# EAGLE design TSOC_GROVEY_FOUR (EAGLE 6.6.0)
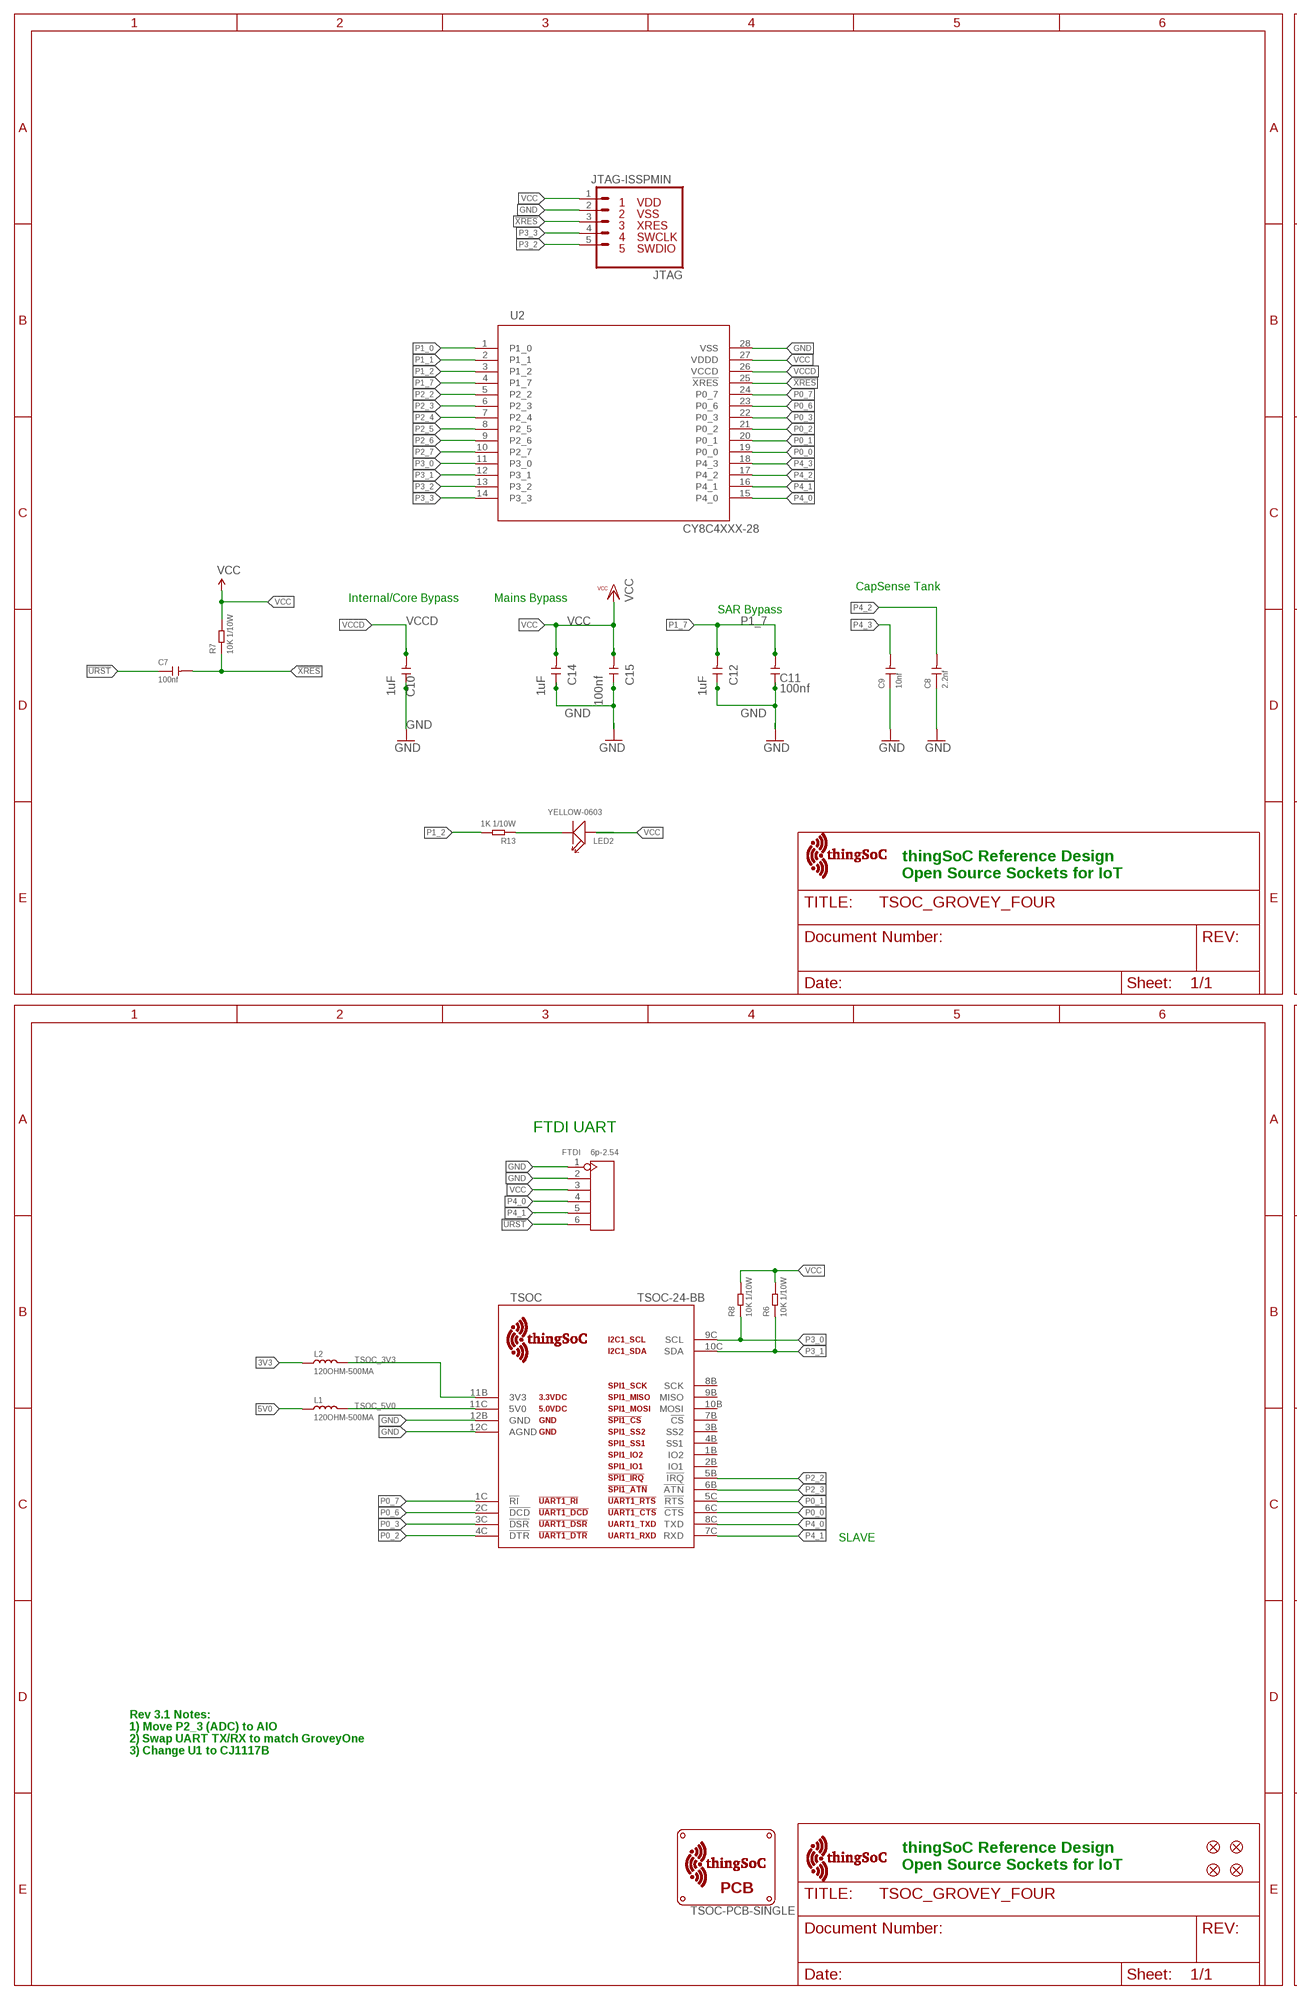
[diagram p0: schematic, sheet 1, part 1 of 2]
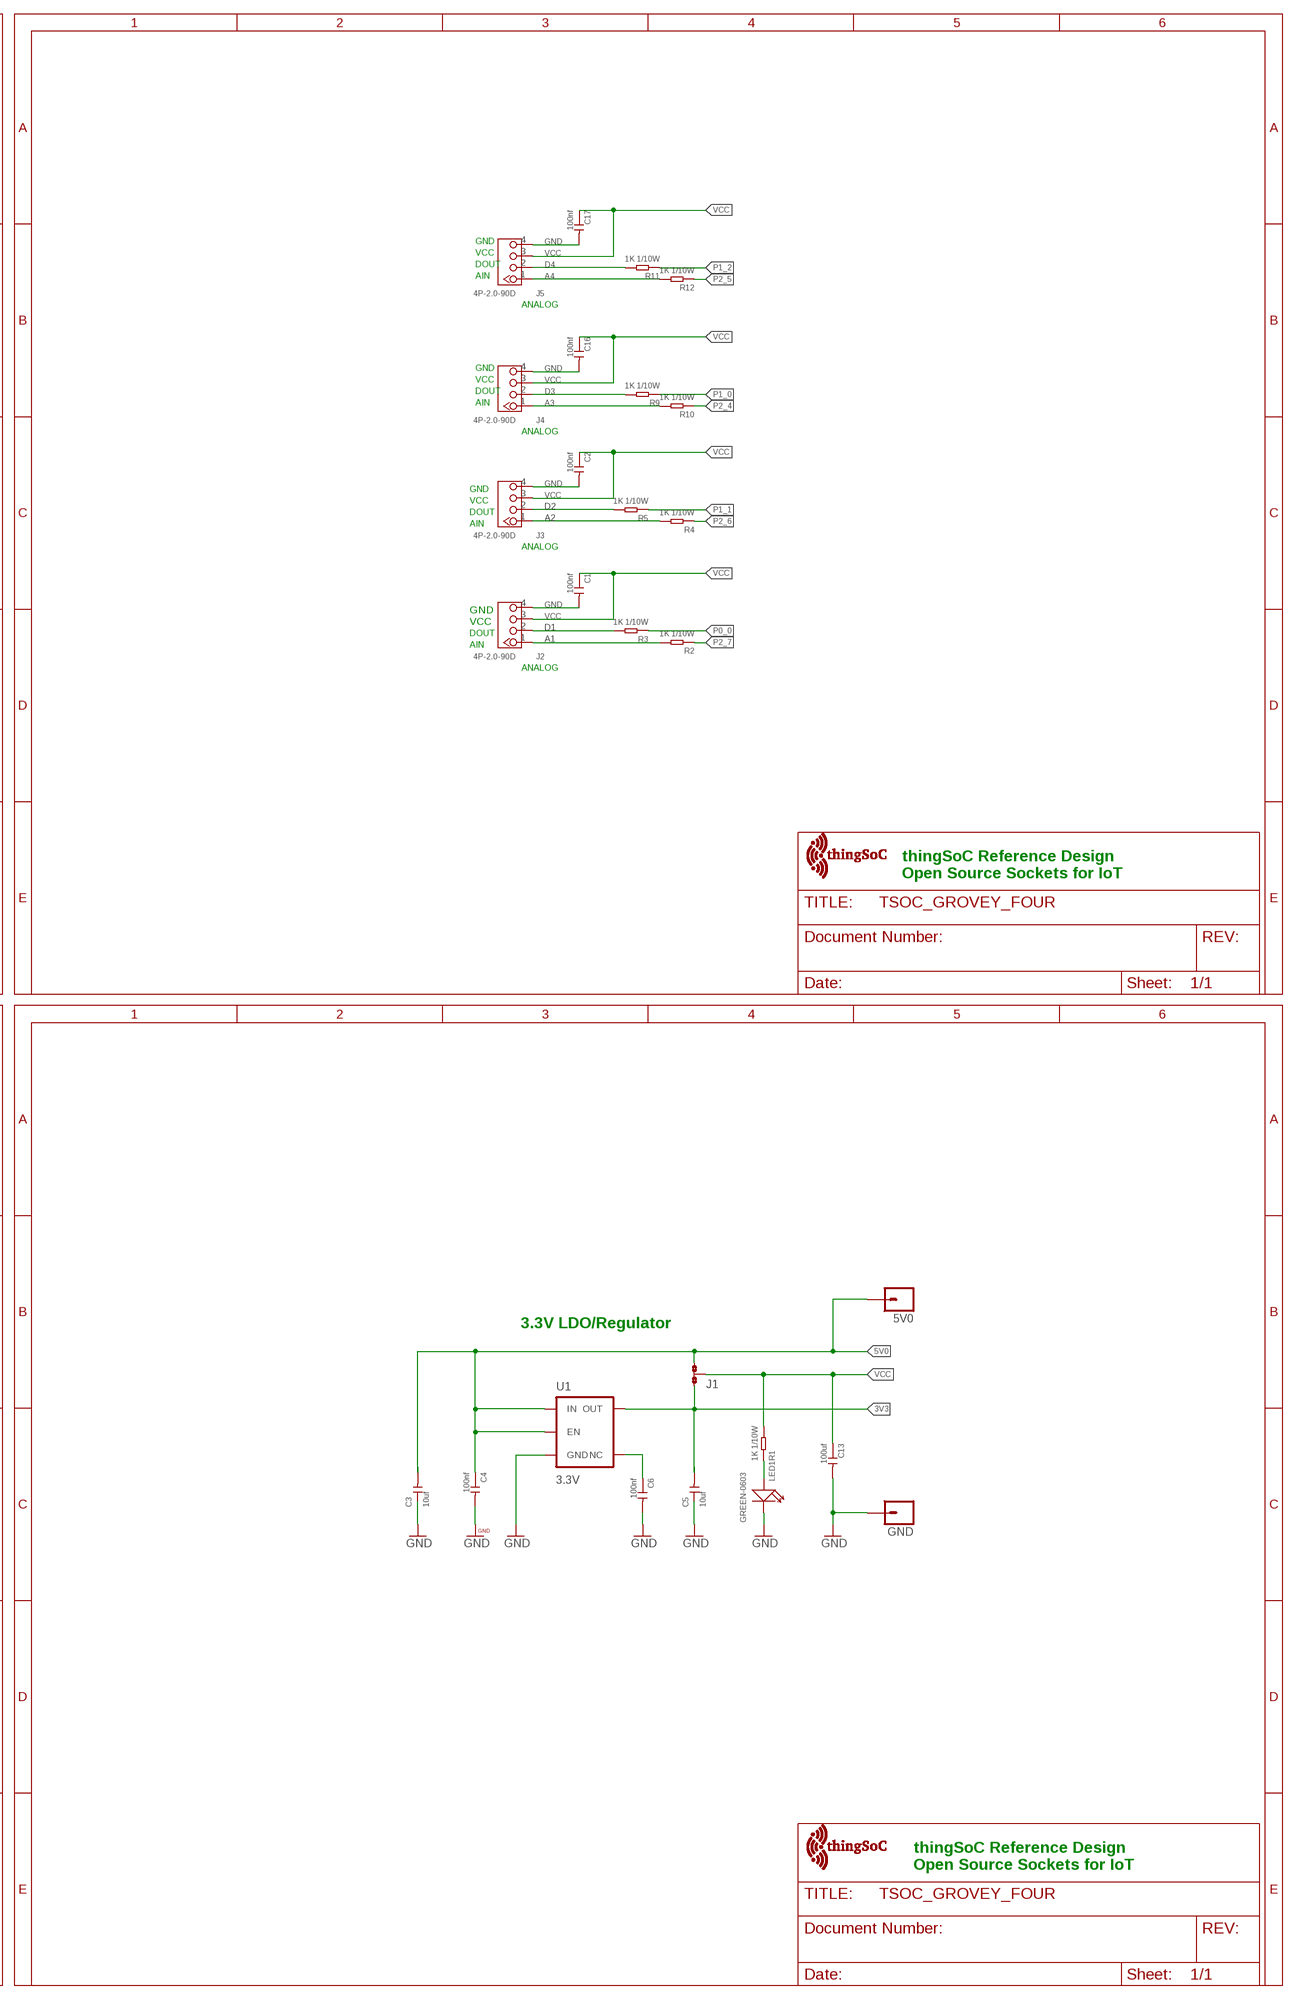
[diagram p1: schematic, sheet 1, part 2 of 2]

## Parts
5V0  M01PTH  [1X01]
$$U$1  TSOC-PCB-SINGLE  [TSOC-BB-BRD-DIM]
C1  100nf  CERAMIC-100NF-50V-10%-X7R(0603)  [C0603]
C2  100nf  CERAMIC-100NF-50V-10%-X7R(0603)  [C0603]
C3  10uf  CERAMIC-10UF-10V-10%-X5R(0603)  [C0603]
C4  100nf  CERAMIC-100NF-50V-10%-X7R(0603)  [C0603]
C5  10uf  CERAMIC-10UF-10V-10%-X5R(0603)  [C0603]
C6  100nf  CERAMIC-100NF-50V-10%-X7R(0603)  [C0603]
C7  100nf  CERAMIC-100NF-50V-10%-X7R(0603)  [C0603]
C8  2.2nf  CERAMIC-1NF-50V-5%-C0G(0603)  [C0603]
C9  10nf  CERAMIC-10NF-50V-10%-X7R(0603)  [C0603]
C10  1uF  CERAMIC-100NF-50V-10%-X7R(0603)  [C0603]
C11  100nf  CERAMIC-100NF-50V-10%-X7R(0603)  [C0603]
C12  1uF  CERAMIC-100NF-50V-10%-X7R(0603)  [C0603]
C13  100uf  CERAMIC-100UF-6.3V-20%-X5R(1206)  [C1206]
C14  1uF  CERAMIC-100NF-50V-10%-X7R(0603)  [C0603]
C15  100nf  CERAMIC-100NF-50V-10%-X7R(0603)  [C0603]
C16  100nf  CERAMIC-100NF-50V-10%-X7R(0603)  [C0603]
C17  100nf  CERAMIC-100NF-50V-10%-X7R(0603)  [C0603]
FID1  FIDUCIALUFIDUCIAL  [MICRO-FIDUCIAL]
FID2  FIDUCIALUFIDUCIAL  [MICRO-FIDUCIAL]
FID3  FIDUCIALUFIDUCIAL  [MICRO-FIDUCIAL]
FID4  FIDUCIALUFIDUCIAL  [MICRO-FIDUCIAL]
FTDI  6p-2.54  DIP-BLACK-MALE-HEADER(6P-2.54)  [H6-2.54]
GND  M01PTH  [1X01]
J1  NO  JMP-3-NO-PTH  [JMP-3-NO-PTH-2.54]
J2  4P-2.0-90D  GROVE-CONNECTOR-DIP-90D(4P-2.0)  [HW4-2.0-90D]
J3  4P-2.0-90D  GROVE-CONNECTOR-DIP-90D(4P-2.0)  [HW4-2.0-90D]
J4  4P-2.0-90D  GROVE-CONNECTOR-DIP-90D(4P-2.0)  [HW4-2.0-90D]
J5  4P-2.0-90D  GROVE-CONNECTOR-DIP-90D(4P-2.0)  [HW4-2.0-90D]
JTAG  JTAG-ISSPMIN  [PSOC_JTAG_MINSILK]
L1  120OHM-500MA  SMD-FERRITE-CHIP-120-OHM-500MA(0603)  [L0603]
L2  120OHM-500MA  SMD-FERRITE-CHIP-120-OHM-500MA(0603)  [L0603]
LED1  GREEN-0603  SMD-LED-CLEAR-GREEN(0603)  [LED-0603]
LED2  YELLOW-0603  SMD-LED-CLEAR-YELLOW(0603)  [LED-0603]
R1  1K 1/10W  SMD-RES-1K-5%-1/10W(0603)  [R0603]
R2  1K 1/10W  SMD-RES-1K-5%-1/10W(0603)  [R0603]
R3  1K 1/10W  SMD-RES-1K-5%-1/10W(0603)  [R0603]
R4  1K 1/10W  SMD-RES-1K-5%-1/10W(0603)  [R0603]
R5  1K 1/10W  SMD-RES-1K-5%-1/10W(0603)  [R0603]
R6  10K 1/10W  SMD-RES-10K-5%-1/10W(0603)  [R0603]
R7  10K 1/10W  SMD-RES-10K-5%-1/10W(0603)  [R0603]
R8  10K 1/10W  SMD-RES-10K-5%-1/10W(0603)  [R0603]
R9  1K 1/10W  SMD-RES-1K-5%-1/10W(0603)  [R0603]
R10  1K 1/10W  SMD-RES-1K-5%-1/10W(0603)  [R0603]
R11  1K 1/10W  SMD-RES-1K-5%-1/10W(0603)  [R0603]
R12  1K 1/10W  SMD-RES-1K-5%-1/10W(0603)  [R0603]
R13  1K 1/10W  SMD-RES-1K-5%-1/10W(0603)  [R0603]
TSOC  TSOC-24-BB  [TSOC-BB-S24]
U1  3.3V  V_REG_AP2112K-3.3V  [SOT23-5]
U2  CY8C4XXX-28  [SSOP28]
U$1  TSOC-LOGO-SMALL  [TSOC-LOGO-SML]
U$4  TSOC-LOGO  [TSOC-LOGO-BLANK]
U$101  TSOC-LOGO-LRG  [TSOC-LOGO-LRG]
U$102  TSOC-LOGO-SMALL  [TSOC-LOGO-SML]

## Nets
3V3: C5.2 J1.1 L2.1 U1.5(OUT)
5V0: 5V0.1 C3.2 C4.1 J1.3 L1.1 U1.1(IN) U1.3(EN)
!URST: C7.1 FTDI.6
!XRES: C7.2 JTAG.3 R7.1 U2.25(!XRES)
A1: J2.1 R2.2
A2: J3.1 R4.2
A3: J4.1 R10.2
A4: J5.1 R12.2
D1: J2.2 R3.2
D2: J3.2 R5.2
D3: J4.2 R9.2
D4: J5.2 R11.2
GND: C1.2 C2.2 C3.1 C4.2 C5.1 C6.2 C8.1 C9.1 C10.1 C11.1 C12.1 C13.2 C14.1 C15.1 C16.2 C17.2 FTDI.1 FTDI.2 GND.1 J2.4 J3.4 J4.4 J5.4 JTAG.2 LED1.- TSOC.12B(GND) TSOC.12C(AGND) U1.2(GND) U2.28(VSS)
LED1: LED1.+ R1.1
LED2: LED2.- R13.1
N$1: C6.1 U1.4(NC)
P0_0: R3.1 TSOC.6C(!CTS) U2.19(P0_0)
P0_1: TSOC.5C(!RTS) U2.20(P0_1)
P0_2: TSOC.4C(!DTR) U2.21(P0_2)
P0_3: TSOC.3C(!DSR) U2.22(P0_3)
P0_6: TSOC.2C(!DCD) U2.23(P0_6)
P0_7: TSOC.1C(!RI) U2.24(P0_7)
P1_0: R9.1 U2.1(P1_0)
P1_1: R5.1 U2.2(P1_1)
P1_2: R11.1 R13.2 U2.3(P1_2)
P1_7: C11.2 C12.2 U2.4(P1_7)
P2_2: TSOC.5B(!IRQ) U2.5(P2_2)
P2_3: TSOC.6B(!ATN) U2.6(P2_3)
P2_4: R10.1 U2.7(P2_4)
P2_5: R12.1 U2.8(P2_5)
P2_6: R4.1 U2.9(P2_6)
P2_7: R2.1 U2.10(P2_7)
P3_0: R8.1 TSOC.9C(SCL) U2.11(P3_0)
P3_1: R6.1 TSOC.10C(SDA) U2.12(P3_1)
P3_2: JTAG.5 U2.13(P3_2)
P3_3: JTAG.4 U2.14(P3_3)
P4_0: FTDI.4 TSOC.8C(TXD) U2.15(P4_0)
P4_1: FTDI.5 TSOC.7C(RXD) U2.16(P4_1)
P4_2: C8.2 U2.17(P4_2)
P4_3: C9.2 U2.18(P4_3)
TSOC_3V3: L2.2 TSOC.11B(3V3)
TSOC_5V0: L1.2 TSOC.11C(5V0)
VCC: C1.1 C2.1 C13.1 C14.2 C15.2 C16.1 C17.1 FTDI.3 J1.2 J2.3 J3.3 J4.3 J5.3 JTAG.1 LED2.+ R1.2 R6.2 R7.2 R8.2 U2.27(VDDD)
VCCD: C10.2 U2.26(VCCD)
Unconnected: TSOC.1B(IO2) TSOC.2B(IO1) TSOC.3B(SS2) TSOC.4B(SS1) TSOC.7B(!CS) TSOC.8B(SCK) TSOC.9B(MISO) TSOC.10B(MOSI)

## Notes on the sheet
- GND
- VCC
- DOUT
- AIN
- ANALOG
- GND
- VCC
- DOUT
- AIN
- ANALOG
- GND
- VCC
- DOUT
- AIN
- ANALOG
- CapSense Tank
- Internal/Core Bypass | Mains Bypass
- SAR Bypass | GND
- VCC
- DOUT
- AIN
- ANALOG
- thingSoC Reference Design
  Open Source Sockets for IoT
- thingSoC Reference Design
  Open Source Sockets for IoT
- FTDI UART
- 3.3V LDO/Regulator
- SLAVE
- Rev 3.1 Notes:
  1) Move P2_3 (ADC) to AIO
  2) Swap UART TX/RX to match GroveyOne
  3) Change U1 to CJ1117B
- thingSoC Reference Design
  Open Source Sockets for IoT
- thingSoC Reference Design
  Open Source Sockets for IoT

## Library data of the parts
5V0 GND = PatternAgents-ProtoPads:M01: Header 1 Standard 1-pin 0.1" header. Use with straight break away headers (SKU : PRT-00116), right angle break away headers (PRT-00553), swiss pins (PRT-00743), machine pins (PRT-00117), and female headers (PRT-00115). SMTSO-256-ET is a "flush mount" nut for a 4-40 screw. The older package used to be too tight, and did not allow it to sit properly thru the drill hit. The latest (0.165DIA) fits nice and snug.
$$U$1 = thingSoC:TSOC-PCB: thingSoC PCB Outlines Boards Outlines for Standard Sizes (in the DImension Layer) (Registration marks in the tDocu layer - make sure to turn on tDocu/bDocu) Source LBR : http://www.thingsoc.com Github : https://github.com/thingsoc License : http://creativecommons.org/licenses/by-sa/4.0/ (Creative Commons 4.0) THIS SOFTWARE IS PROVIDED BY THE CONTRIBUTORS "AS IS" AND WITHOUT ANY EXPRESS OR IMPLIED WARRANTIES, INCLUDING, BUT NOT LIMITED TO, THE IMPLIED WARRANTIES OF MERCHANTABILITY AND FITNESS FOR A PARTICULAR PURPOSE ARE DISCLAIMED. IN NO EVENT SHALL THE COPYRIGHT OWNER OR CONTRIBUTORS BE LIABLE FOR ANY DIRECT, INDIRECT, INCIDENTAL, SPECIAL, EXEMPLARY, OR CONSEQUENTIAL DAMAGES (INCLUDING, BUT NOT LIMITED TO, PROCUREMENT OF SUBSTITUTE GOODS OR SERVICES; LOSS OF USE, DATA, OR PROFITS; OR BUSINESS INTERRUPTION) HOWEVER CAUSED AND ON ANY THEORY OF LIABILITY, WHETHER IN CONTRACT, STRICT LIABILITY, OR TORT (INCLUDING NEGLIGENCE OR OTHERWISE) ARISING IN ANY WAY OUT OF THE USE OF THIS SOFTWARE, EVEN IF ADVISED OF THE POSSIBILITY OF SUCH DAMAGE.
C1 C2 C4 C6 C7 C11 C15-C17 = Seeed-Capacitor-2016:CERAMIC-100NF-50V-10%-X7R(0603): 302010138; MPN: CC0603KRX7R9BB104
C3 C5 = Seeed-Capacitor-2016:CERAMIC-10UF-10V-10%-X5R(0603): 302010103; MPN: CC0603KRX5R6BB106
C8 = Seeed-Capacitor-2016:CERAMIC-1NF-50V-5%-C0G(0603): 302010341; MPN: GRM1885C1H102JA01D; VALUE: 1nf
C9 = Seeed-Capacitor-2016:CERAMIC-10NF-50V-10%-X7R(0603): 302010140; MPN: CC0603KRX7R9BB103
C10 C12 C14 = Seeed-Capacitor-2016:CERAMIC-100NF-50V-10%-X7R(0603): 302010138; MPN: CC0603KRX7R9BB104; VALUE: 100nf
C13 = Seeed-Capacitor-2016:CERAMIC-100UF-6.3V-20%-X5R(1206): 302010183; MPN: GRM31CR60J107ME39L
FID1-FID4 = TSOC-ESP8266-BASE:FIDUCIAL: Fiducial Alignment Points Various fiducial points for machine vision alignment.
FTDI = Seeed-Connector -2016:DIP-BLACK-MALE-HEADER(6P-2.54): 320020078; MPN: P125-1106A1BS116A1
J1 = PatternAgents-ProtoPads:JMP-3-NO: Three Terminal Jumper - Normally Open All Pads Open (unconnected) PatternAgents ProtoPads Library Schematic and PCB layout libraries for design patterns by PatternAgents. For the CADSoft Eagle CAD program : http://www.cadsoftusa.com/download-eagle/ Source LBR : http://www.patternagents.com Github : https://github.com/PatternAgents License : http://creativecommons.org/licenses/by-sa/4.0/ (Creative Commons 4.0) THIS SOFTWARE IS PROVIDED BY THE CONTRIBUTORS "AS IS" AND WITHOUT ANY EXPRESS OR IMPLIED WARRANTIES, INCLUDING, BUT NOT LIMITED TO, THE IMPLIED WARRANTIES OF MERCHANTABILITY AND FITNESS FOR A PARTICULAR PURPOSE ARE DISCLAIMED. IN NO EVENT SHALL THE COPYRIGHT OWNER OR CONTRIBUTORS BE LIABLE FOR ANY DIRECT, INDIRECT, INCIDENTAL, SPECIAL, EXEMPLARY, OR CONSEQUENTIAL DAMAGES (INCLUDING, BUT NOT LIMITED TO, PROCUREMENT OF SUBSTITUTE GOODS OR SERVICES; LOSS OF USE, DATA, OR PROFITS; OR BUSINESS INTERRUPTION) HOWEVER CAUSED AND ON ANY THEORY OF LIABILITY, WHETHER IN CONTRACT, STRICT LIABILITY, OR TORT (INCLUDING NEGLIGENCE OR OTHERWISE) ARISING IN ANY WAY OUT OF THE USE OF THIS SOFTWARE, EVEN IF ADVISED OF THE POSSIBILITY OF SUCH DAMAGE.
J2-J5 = Seeed-Connector -2016:GROVE-CONNECTOR-DIP-90D(4P-2.0): 320110034
JTAG = PatternAgents-Cypress:JTAG-ISSP: JTAG-ISSP Programming Connector (5 Pin ISSP JTAG Connector) LBR Source: http://www.patternagents.com THIS SOFTWARE IS PROVIDED BY THE CONTRIBUTORS "AS IS" AND WITHOUT ANY EXPRESS OR IMPLIED WARRANTIES, INCLUDING, BUT NOT LIMITED TO, THE IMPLIED WARRANTIES OF MERCHANTABILITY AND FITNESS FOR A PARTICULAR PURPOSE ARE DISCLAIMED. IN NO EVENT SHALL THE COPYRIGHT OWNER OR CONTRIBUTORS BE LIABLE FOR ANY DIRECT, INDIRECT, INCIDENTAL, SPECIAL, EXEMPLARY, OR CONSEQUENTIAL DAMAGES (INCLUDING, BUT NOT LIMITED TO, PROCUREMENT OF SUBSTITUTE GOODS OR SERVICES; LOSS OF USE, DATA, OR PROFITS; OR BUSINESS INTERRUPTION) HOWEVER CAUSED AND ON ANY THEORY OF LIABILITY, WHETHER IN CONTRACT, STRICT LIABILITY, OR TORT (INCLUDING NEGLIGENCE OR OTHERWISE) ARISING IN ANY WAY OUT OF THE USE OF THIS SOFTWARE, EVEN IF ADVISED OF THE POSSIBILITY OF SUCH DAMAGE.
L1 L2 = Seeed-Inductor-2016:SMD-FERRITE-CHIP-120-OHM-500MA(0603): 303030001; MPN: BLM18AG121SN1D
LED1 = Seeed-LED-2016:SMD-LED-CLEAR-GREEN(0603): 304090043; MPN: 19-217-G7C-AN1P2-3T
LED2 = Seeed-LED-2016:SMD-LED-CLEAR-YELLOW(0603): 304090044; MPN: 19-217-Y5C-AM1N1VY-3T
R1-R5 R9-R13 = Seeed-Resistor-2016:SMD-RES-1K-5%-1/10W(0603): 301010291; MPN: RC0603JR-071KL
R6-R8 = Seeed-Resistor-2016:SMD-RES-10K-5%-1/10W(0603): 301010293; MPN: RC0603JR-0710KL
TSOC = thingSoC:TSOC-24: thingSoC Twenty-Four(24) Pin Socket Source LBR : http://www.thingsoc.com Github : https://github.com/thingsoc License : http://creativecommons.org/licenses/by-sa/4.0/ (Creative Commons 4.0) THIS SOFTWARE IS PROVIDED BY THE CONTRIBUTORS "AS IS" AND WITHOUT ANY EXPRESS OR IMPLIED WARRANTIES, INCLUDING, BUT NOT LIMITED TO, THE IMPLIED WARRANTIES OF MERCHANTABILITY AND FITNESS FOR A PARTICULAR PURPOSE ARE DISCLAIMED. IN NO EVENT SHALL THE COPYRIGHT OWNER OR CONTRIBUTORS BE LIABLE FOR ANY DIRECT, INDIRECT, INCIDENTAL, SPECIAL, EXEMPLARY, OR CONSEQUENTIAL DAMAGES (INCLUDING, BUT NOT LIMITED TO, PROCUREMENT OF SUBSTITUTE GOODS OR SERVICES; LOSS OF USE, DATA, OR PROFITS; OR BUSINESS INTERRUPTION) HOWEVER CAUSED AND ON ANY THEORY OF LIABILITY, WHETHER IN CONTRACT, STRICT LIABILITY, OR TORT (INCLUDING NEGLIGENCE OR OTHERWISE) ARISING IN ANY WAY OUT OF THE USE OF THIS SOFTWARE, EVEN IF ADVISED OF THE POSSIBILITY OF SUCH DAMAGE.
U1 = SparkFun-PowerIC:V_REG_AP2112: AP2112 - 600mA CMOS LDO Regulator w/ Enable The AP2112 is CMOS process low dropout linear regulator with enable function, the regulator delivers a guaranteed 600mA (min.) continuous load current. Features Output Voltage Accuracy: ±1.5% Output Current: 600mA (Min.) Foldback Short Current Protection: 50mA Enable Function to Turn ON/OFF VOUT Low Dropout Voltage (3.3V): 250mV (Typ.) @IOUT=600mA Excellent Load Regulation: 0.2%/A (Typ.) Excellent Line Regulation: 0.02%/V (Typ.) Low Quiescent Current: 55μA (Typ.) Low Standby Current: 0.01μA (Typ.) Low Output Noise: 50μVRMS PSRR: 100Hz -65dB, 1kHz -65dB OTSD Protection Stable with 1.0μF Flexible Cap: Ceramic, Tantalum and Aluminum Electrolytic Operation Temperature Range: -40°C to 85°C ESD: MM 400V, HBM 4000V; PROD_ID: VREG-12457
U2 = PatternAgents-Cypress:CY8C4XXX-28: Cypress PSoC® 4 - Programmable System on Chip, Cortex-M0 Based http://www.cypress.com/?mpn=CY8C4245PVI-482 LBR Source: http://www.patternagents.com THIS SOFTWARE IS PROVIDED BY THE CONTRIBUTORS "AS IS" AND WITHOUT ANY EXPRESS OR IMPLIED WARRANTIES, INCLUDING, BUT NOT LIMITED TO, THE IMPLIED WARRANTIES OF MERCHANTABILITY AND FITNESS FOR A PARTICULAR PURPOSE ARE DISCLAIMED. IN NO EVENT SHALL THE COPYRIGHT OWNER OR CONTRIBUTORS BE LIABLE FOR ANY DIRECT, INDIRECT, INCIDENTAL, SPECIAL, EXEMPLARY, OR CONSEQUENTIAL DAMAGES (INCLUDING, BUT NOT LIMITED TO, PROCUREMENT OF SUBSTITUTE GOODS OR SERVICES; LOSS OF USE, DATA, OR PROFITS; OR BUSINESS INTERRUPTION) HOWEVER CAUSED AND ON ANY THEORY OF LIABILITY, WHETHER IN CONTRACT, STRICT LIABILITY, OR TORT (INCLUDING NEGLIGENCE OR OTHERWISE) ARISING IN ANY WAY OUT OF THE USE OF THIS SOFTWARE, EVEN IF ADVISED OF THE POSSIBILITY OF SUCH DAMAGE.
U$1 U$4 U$101 U$102 = thingSoC:TSOC-LOGO: thingSoC Logo Source LBR : http://www.thingsoc.com Github : https://github.com/thingsoc License : http://creativecommons.org/licenses/by-sa/4.0/ (Creative Commons 4.0) THIS SOFTWARE IS PROVIDED BY THE CONTRIBUTORS "AS IS" AND WITHOUT ANY EXPRESS OR IMPLIED WARRANTIES, INCLUDING, BUT NOT LIMITED TO, THE IMPLIED WARRANTIES OF MERCHANTABILITY AND FITNESS FOR A PARTICULAR PURPOSE ARE DISCLAIMED. IN NO EVENT SHALL THE COPYRIGHT OWNER OR CONTRIBUTORS BE LIABLE FOR ANY DIRECT, INDIRECT, INCIDENTAL, SPECIAL, EXEMPLARY, OR CONSEQUENTIAL DAMAGES (INCLUDING, BUT NOT LIMITED TO, PROCUREMENT OF SUBSTITUTE GOODS OR SERVICES; LOSS OF USE, DATA, OR PROFITS; OR BUSINESS INTERRUPTION) HOWEVER CAUSED AND ON ANY THEORY OF LIABILITY, WHETHER IN CONTRACT, STRICT LIABILITY, OR TORT (INCLUDING NEGLIGENCE OR OTHERWISE) ARISING IN ANY WAY OUT OF THE USE OF THIS SOFTWARE, EVEN IF ADVISED OF THE POSSIBILITY OF SUCH DAMAGE.

## Board
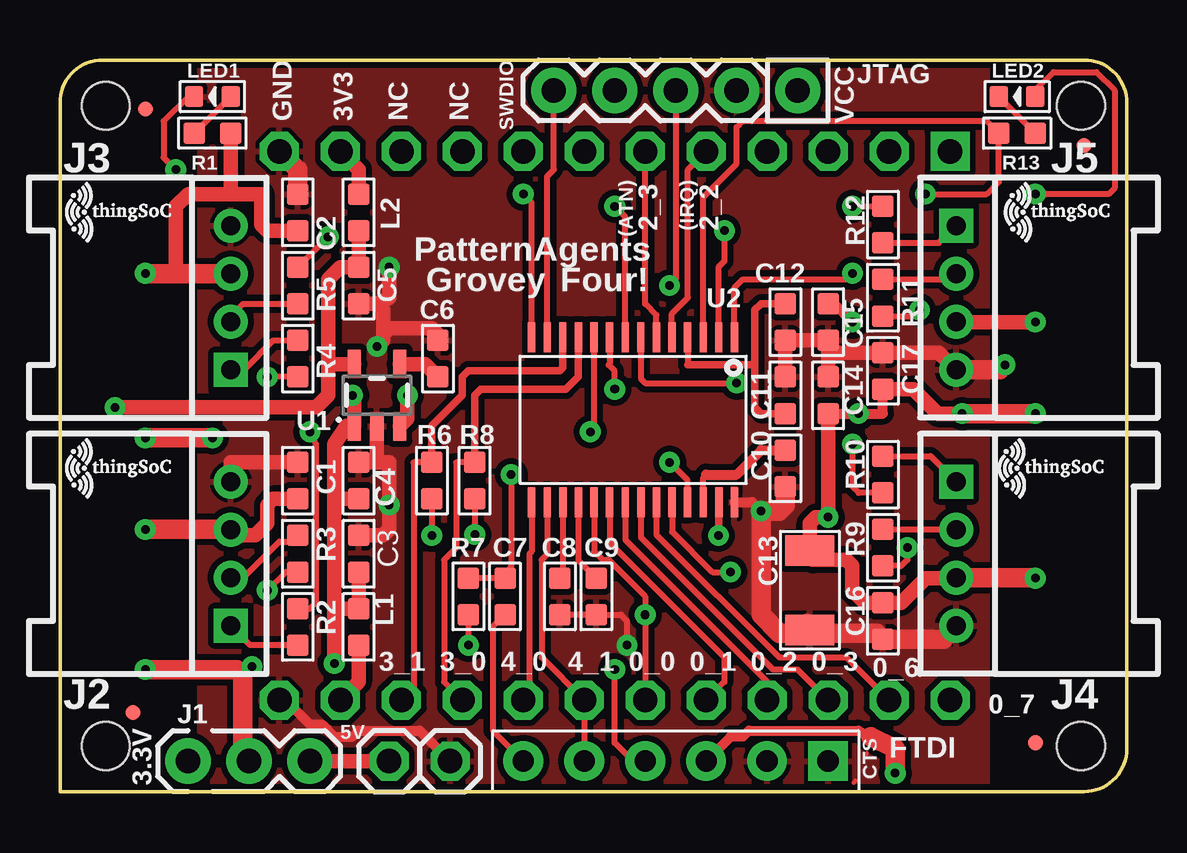
[diagram p2: board, top side]
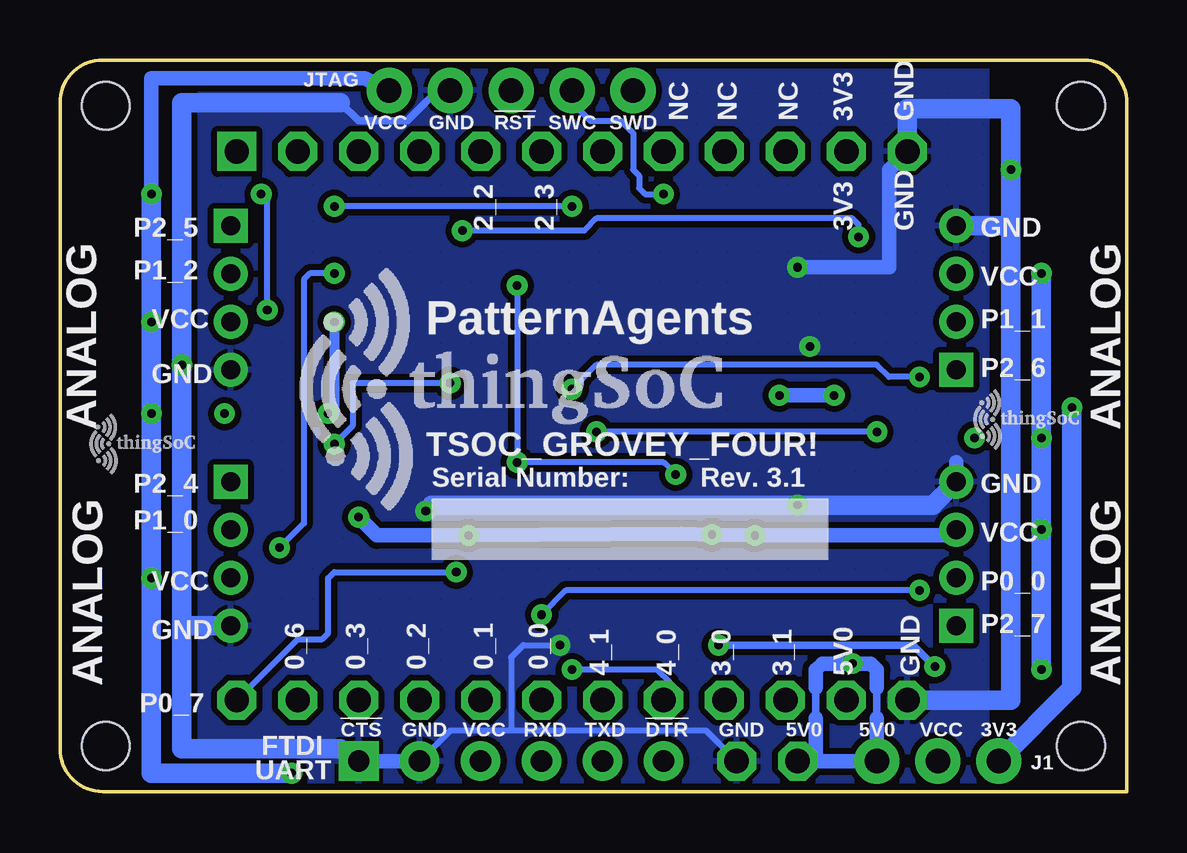
[diagram p3: board, bottom side, seen from below]

Size 44.45 x 30.48 mm. Coordinates in mm from the lower left corner, seen from the top.
Copper layers (1*16): Top 0.035mm / dielectric 1.5mm / Bottom 0.035mm
Design rules "PatternAgents_7mil": minimum track width 7mil, minimum drill 14mil, track to track 7mil, track to pad 7mil, pad to pad 7mil, via to via 7mil, smd to smd 7mil, copper to edge 7mil, drill to drill 7mil, minimum pad ring 12mil, minimum via ring 10mil, stop-mask expansion 4mil, vias tented up to drill 25mil, thermal gap 7mil

### Footprints (pad centres in the part's own frame; a part is rotated, then mirrored left to right if it is on the bottom)
1X01 = drill 1.016 octagon: 1 0,0
TSOC-BB-BRD-DIM = hole 2: 13.335,16.891; -13.335,16.891; 13.335,-23.749; -13.335,-23.749
C0603 = smd 0.889 x 0.889: 1 0,0.762; 2 0,-0.762
C1206 = smd 1.27 x 2.032: 1 -1.651,0; 2 1.651,0
MICRO-FIDUCIAL = smd 0.635 x 0.635: 1 0,0
H6-2.54 = drill 0.889 pad 1.651 square: 1 0,6.35 | drill 0.889 pad 1.651: 2 0,3.81; 3 0,1.27; 4 0,-1.27; 5 0,-3.81; 6 0,-6.35
JMP-3-NO-PTH-2.54 = drill 1.016 pad 1.88: 1 0,0; 2 2.54,0; 3 5.08,0
HW4-2.0-90D = drill 0.8 pad 1.27 square: 1 -3,0 | drill 0.8 pad 1.27: 2 -1,0; 3 1,0; 4 3,0
PSOC_JTAG_MINSILK = drill 1.016 pad 1.88: 1 -5.08,0; 2 -2.54,0; 3 0,0; 4 2.54,0; 5 5.08,0
L0603 = smd 0.889 x 0.889: 1 -0.762,0; 2 0.762,0
LED-0603 = smd 0.762 x 0.889: + -0.762,0; - 0.762,0
R0603 = smd 0.889 x 0.889: 1 0,0.762; 2 0,-0.762
TSOC-BB-S24 = drill 1.016 square: 1B -11.43,11.43 | drill 1.016 octagon: 1C 11.43,11.43; 2B -11.43,8.89; 2C 11.43,8.89; 3B -11.43,6.35; 3C 11.43,6.35; 4B -11.43,3.81; 4C 11.43,3.81; 5B -11.43,1.27; 5C 11.43,1.27; 6B -11.43,-1.27; 6C 11.43,-1.27; 7B -11.43,-3.81; 7C 11.43,-3.81; 8B -11.43,-6.35; 8C 11.43,-6.35; 9B -11.43,-8.89; 9C 11.43,-8.89; 10B -11.43,-11.43; 10C 11.43,-11.43; 11B -11.43,-13.97; 11C 11.43,-13.97; 12B -11.43,-16.51; 12C 11.43,-16.51
SOT23-5 = smd 0.55 x 1.2: 1 -0.95,-1.3; 2 0,-1.3; 3 0.95,-1.3; 4 0.95,1.3; 5 -0.95,1.3
SSOP28 = smd 0.305 x 1.245: 1 4.224,3.441; 2 3.574,3.441; 3 2.924,3.441; 4 2.274,3.441; 5 1.624,3.441; 6 0.974,3.441; 7 0.325,3.44; 8 -0.326,3.441; 9 -0.976,3.441; 10 -1.626,3.441; 11 -2.276,3.441; 12 -2.926,3.441; 13 -3.576,3.441; 14 -4.226,3.441; 15 -4.224,-3.441; 16 -3.574,-3.441; 17 -2.924,-3.441; 18 -2.274,-3.441; 19 -1.624,-3.441; 20 -0.974,-3.441; 21 -0.324,-3.441; 22 0.326,-3.441; 23 0.976,-3.441; 24 1.626,-3.441; 25 2.276,-3.441; 26 2.926,-3.441; 27 3.576,-3.441; 28 4.226,-3.441

### Placement (x,y rotation side)
5V0  13.72,1.27 0 top
$$U$1  25.65,15.24 270 top
$$U$2  TSOC-LOGO-SMALL  [TSOC-LOGO-SML]  39.88,13.46 0 top
$$U$3  TSOC-LOGO-SMALL  [TSOC-LOGO-SML]  40.13,24.13 0 top
C1  9.91,12.95 180 top
C2  9.91,24.13 180 top
C3  12.45,9.91 0 top
C4  12.45,12.95 180 top
C5  12.45,21.08 180 top
C6  15.75,18.03 180 top
C7  18.54,8.13 180 top
C8  20.83,8.13 180 top
C9  22.35,8.13 180 top
C10  30.23,13.46 180 top
C11  30.23,16.51 0 top
C12  30.23,19.56 180 top
C13  31.24,8.38 270 top
C14  32,16.51 0 top
C15  32,19.56 180 top
C16  34.29,7.11 0 top
C17  34.29,17.53 180 top
FID1  3.05,3.3 0 top
FID2  3.56,28.45 0 top
FID3  40.64,2.03 0 top
FID4  42.67,26.92 0 top
FTDI  25.65,1.27 270 top
GND  16.26,1.27 0 top
J1  5.33,1.27 0 top
J2  7.11,9.91 90 top
J3  7.11,20.57 90 top
J4  37.34,9.91 270 top
J5  37.34,20.57 270 top
JTAG  25.65,29.21 180 top
L1  12.45,6.86 270 top
L2  12.45,24.13 90 top
LED1  6.35,28.96 180 top
LED2  39.88,28.96 180 top
R1  6.35,27.43 90 top
R2  9.91,6.86 0 top
R3  9.91,9.91 180 top
R4  9.91,18.03 180 top
R5  9.91,21.08 0 top
R6  15.49,12.95 0 top
R7  17.02,8.13 0 top
R8  17.27,12.95 0 top
R9  34.29,10.16 180 top
R10  34.29,13.21 180 top
R11  34.29,20.57 180 top
R12  34.29,23.62 0 top
R13  39.88,27.43 270 top
TSOC  25.65,15.24 270 top
U1  13.21,16.51 0 top
U2  23.88,15.49 0 top
U$1  1.02,13.46 0 top
U$3  TSOC-LOGO-SMALL  [TSOC-LOGO-SML]  1.02,24.13 0 top
U$4  0,0 0 top
U$100  TSOC-LOGO-SMALL  [TSOC-LOGO-SML]  5.59,15.49 0 bottom
U$101  31.24,16.76 0 bottom
U$102  42.42,14.48 0 bottom

### Tracks (layer width: path | path; a pad name or v marks a point on that pad's centre or on a via)
3V3  (via drill 0.36)
  Top 0.61: L2.1 C5.2 11.68,21.84 11.18,21.34 11.18,17.78 | 11.18,17.78 11.18,16.51 10.67,16 v2.29,16 | U1.5 11.21,17.81 11.18,17.78
  Bottom 0.813: v2.29,16 2.29,4.32 J1.1
5V0  (via drill 0.36)
  Top 0.61: C3.2 L1.1 11.43,7.62 | 11.43,12.19 11.43,14.48 11.94,15.24 11.97,15.21 U1.1 12.26,16.44 v12.19,16.51 | 11.43,12.19 11.43,7.62 | 11.43,7.62 v11.43,5.33 | C4.1 11.43,12.19 | 5V0.1 J1.3 | v14.48,16.51 14.48,15.53 U1.3
  Bottom 0.305: 10.41,3.05 10.41,4.32 | 12.95,4.32 12.95,3.05
  Bottom 0.61: 12.95,4.32 12.95,5.08 12.7,5.33 v11.43,5.33 10.67,5.33 10.41,5.08 10.41,4.32 | 10.41,3.05 J1.3 | 12.95,1.27 J1.3 | 12.95,3.05 12.95,1.27 | 12.95,1.27 5V0.1 J1.3 | v12.19,16.51 v14.48,16.51
!URST
  Top 0.254: FTDI.6 18.03,2.54 18.03,6.86 C7.1
!XRES  (via drill 0.36)
  Top 0.254: JTAG.3 25.65,21.34 v25.4,21.08 | U2.25 26.15,12.96 v25.4,13.72 | v18.8,13.21 18.8,9.4 C7.2 R7.1
  Bottom 0.254: v25.4,21.08 v25.4,13.72 19.3,13.72 v18.8,13.21
A1
  Top 0.254: R2.2 7.92,6.1 J2.1
A2
  Top 0.254: J3.1 7.67,17.57 8.89,18.8 R4.2
A3
  Top 0.254: R10.2 36.27,13.97 J4.1
A4
  Top 0.254: R12.2 36.62,22.86 J5.1
D1
  Top 0.254: J2.2 7.64,8.91 9.14,10.41 9.65,10.41 R3.2
D2
  Top 0.254: J3.2 7.11,19.81 7.62,20.32 R5.2
D3
  Top 0.254: R9.2 37.32,10.92 J4.2
D4
  Top 0.254: R11.2 37.1,21.34 J5.2
GND  (via drill 0.36)
  Top 0.178: C4.2 12.45,13.87 12.54,13.81 | 12.8,13.69 C4.2 | 12.62,13.69 C4.2 | C4.2 12.8,13.87 12.8,13.81 | C4.2 12.45,13.69 12.54,13.62 | 7.04,12.98 6.93,12.98 J2.4 6.93,12.8 7.04,12.83 | 9.6,13.69 C1.2 | 9.25,13.51 9.25,13.62 | C1.2 9.6,13.51 9.6,13.62 | C12.1 30.23,18.85 30.13,18.89 | 9.42,13.51 9.42,13.62 | 9.78,13.69 C1.2 | 32.1,1.18 32,1.25 FTDI.1 | 33.6,1.6 33.56,1.52 | 33.07,0.36 33.13,0.46
  Top 0.254: LED1.- 5.33,28.96 4.32,27.94 4.32,26.42 v4.83,25.91 | C8.1 C9.1 23.37,7.37 23.62,7.11 v23.62,6.1
  Top 0.406: TSOC.12C 9.4,3.81 10.41,2.79 10.92,2.79 11.43,2.29 12.19,2.29 12.45,2.54 14.99,2.54 GND.1 | U2.28 28.84,12.05 v29.21,11.68
  Top 0.61: C1.2 7.11,13.72 J2.4 | J5.4 36.62,18.29 C17.2 32,18.29 | 31.24,6.6 C13.2 31.11,7.11 | 13.21,20.32 13.72,20.57 v13.72,21.84 | 13.21,20.32 C5.1 12.57,20.19 | C14.1 32,18.29 | 32,18.29 C15.1 C12.1 C11.1 | v13.21,18.54 13.46,18.8 13.46,19.05 | 13.46,19.05 13.46,20.07 13.21,20.32 | C6.2 15.75,19.05 15.49,19.3 13.72,19.3 13.46,19.05 | C3.1 13.46,10.67 13.72,10.92 v13.72,11.94 13.72,13.72 13.21,13.72 | C4.2 13.21,13.72 | U1.2 13.21,13.72
  Top 0.813: C2.2 9.91,25.91 TSOC.12B | J5.4 39.16,17.57 v39.37,17.78 | C10.1 30.23,11.94 29.97,11.68 v29.21,11.68 29.21,7.37 29.97,6.6 31.24,6.6 | C13.2 31.62,6.6 34.04,6.6 C16.2 36.83,6.35 37.34,6.86 J4.4
  Bottom 0.254: 25.65,2.54 17.53,2.54 GND.1 | 25.65,2.54 28.19,2.54 FTDI.2 | 25.65,2.54 25.65,5.59 25.15,6.1 v23.62,6.1
  Bottom 0.305: 32.77,28.7 32,27.94 29.97,27.94 28.7,29.21 JTAG.2
  Bottom 0.61: J2.4 7.11,13.72 | v13.72,21.84 9.91,21.84 9.91,25.91 TSOC.12B | FTDI.2 FTDI.1 32.77,1.78
  Bottom 0.813: TSOC.12B 9.14,28.45 4.83,28.45 v4.83,25.91 4.83,23.37 | 39.37,6.86 v39.37,17.78 39.37,28.7 32.77,28.7 | 39.37,6.86 39.37,1.78 32.77,1.78 | 4.83,23.37 4.83,3.81 TSOC.12C | J3.4 5.03,23.57 4.83,23.37 | J4.4 39.32,6.91 39.37,6.86 | v29.21,11.68 28.96,11.94 v13.72,11.94 8.08,11.94 J2.4
  pour Bottom (isolate 0.254, rank 2, hatched): 5.84,0 5.84,30.48 38.61,30.48 38.61,0
  pour Top (isolate 0.254, hatched): 5.84,0 5.84,30.48 38.61,30.48 38.61,0
LED1
  Top 0.254: R1.1 LED1.+
LED2
  Top 0.254: LED2.- R13.1
N$1
  Top 0.61: U1.4 15.21,17.81 C6.1
P0_0  (via drill 0.36)
  Top 0.254: U2.19 22.25,10.01 22.61,9.65 22.86,9.65 24.38,8.13 v24.38,7.37 TSOC.6C | R3.1 9.4,9.14 v8.64,8.38
  Bottom 0.254: v8.64,8.38 23.37,8.38 v24.38,7.37
P0_1
  Top 0.254: U2.20 22.9,10.37 27.69,5.59 27.69,4.57 TSOC.5C
P0_2
  Top 0.254: U2.21 23.55,10.48 29.46,4.57 TSOC.4C
P0_3
  Top 0.254: U2.22 24.2,10.6 29.72,5.08 30.73,5.08 TSOC.3C
P0_6
  Top 0.254: TSOC.2C 32.77,5.59 29.97,5.59 24.85,10.71 U2.23
P0_7  (via drill 0.36)
  Top 0.254: U2.24 25.5,10.82 27.18,9.14 v27.94,9.14
  Bottom 0.254: TSOC.1C 34.54,6.35 33.53,6.35 33.27,6.6 33.27,8.89 33.02,9.14 v27.94,9.14
P1_0  (via drill 0.36)
  Top 0.254: U2.1 28.1,20.99 28.45,21.34 32.77,21.34 v33.02,21.59 | v35.31,10.16 35.31,9.65 35.05,9.4 R9.1
  Bottom 0.254: v33.02,21.59 34.04,21.59 34.29,21.34 34.29,11.18 v35.31,10.16
P1_1  (via drill 0.36)
  Top 0.254: R5.1 v11.18,23.11 | v27.69,23.37 27.69,22.1 27.43,21.84 27.45,21.83 U2.2
  Bottom 0.254: v11.18,23.11 11.18,23.62 11.43,23.88 22.1,23.88 22.61,23.37 v27.69,23.37
P1_2  (via drill 0.36)
  Top 0.254: U2.3 26.8,24.77 28.19,26.16 28.19,27.69 28.45,27.94 38.61,27.94 R13.2 | 39.37,27.18 R13.2 | R11.1 35.56,19.81 v35.81,20.07 | v36.07,24.89 38.61,24.89 39.12,25.4 R13.2
  Bottom 0.254: v35.81,20.07 35.81,24.64 v36.07,24.89
P1_7
  Top 0.254: U2.4 26.15,17.79 26.16,17.78
  Top 0.305: 26.16,17.78 28.96,17.78 | 28.96,17.78 28.96,16 29.21,15.75 C11.2 | C12.2 29.21,20.32 28.96,20.07 28.96,17.78
P2_2
  Top 0.254: U2.5 25.5,19.91 26.16,20.57 26.16,25.91 TSOC.5B
P2_3
  Top 0.254: U2.6 24.85,19.85 24.38,20.32 TSOC.6B
P2_4  (via drill 0.36)
  Top 0.254: R10.1 33.27,12.45 33.02,12.7 v33.02,14.48 | U2.7 24.2,17.2 24.38,17.02 v28.19,17.02
  Bottom 0.254: v28.19,17.02 32.26,17.02 32.26,15.24 v33.02,14.48
P2_5  (via drill 0.36)
  Top 0.254: U2.8 23.55,23.95 v23.11,24.38 | v33.02,24.38 R12.1
  Bottom 0.254: v23.11,24.38 v33.02,24.38
P2_6  (via drill 0.36)
  Top 0.254: R4.1 v8.64,17.27 | v23.11,16.76 23.11,17.53 22.86,17.78 22.9,17.82 U2.9
  Bottom 0.254: v8.64,17.27 R4.1 10.41,17.78 22.1,17.78 v23.11,16.76
P2_7  (via drill 0.36)
  Top 0.254: R2.1 10.41,7.62 10.67,7.87 10.67,14.48 v10.41,14.99 | U2.10 22.25,15.14 v22.1,14.99
  Bottom 0.254: v10.41,14.99 v22.1,14.99
P3_0
  Top 0.254: R8.1 16.51,13.72 16.51,10.16 16,9.65 16,4.57 TSOC.9C
  Top 0.305: U2.11 21.6,17.28 21.08,16.76 17.53,16.76 17.27,16.51 R8.1
P3_1
  Top 0.254: R6.1 14.73,13.72 14.73,4.32 TSOC.10C
  Top 0.305: U2.12 20.95,17.65 20.83,17.53 17.02,17.53 16.76,17.27 16.76,16.51 15.49,15.24 R6.1
P3_2
  Top 0.254: U2.13 20.3,25.63 20.57,25.91 JTAG.5
P3_3  (via drill 0.36)
  Top 0.254: U2.14 19.65,24.55 v19.3,24.89
  Bottom 0.254: JTAG.4 23.11,28.7 22.35,27.94 21.08,27.94 20.57,27.43 20.57,25.91 20.32,25.65 20.32,25.15 20.07,24.89 v19.3,24.89
P4_0  (via drill 0.36)
  Top 0.254: 19.65,12.03 U2.15 19.65,10 19.56,9.91 19.56,4.06 TSOC.8C | FTDI.4 23.88,1.27 23.11,2.03 v23.11,5.08
  Bottom 0.254: TSOC.8C 19.05,4.06 19.05,4.57 19.56,5.08 v23.11,5.08
P4_1
  Top 0.254: U2.16 20.3,9.89 20.07,9.65 20.07,5.59 TSOC.7C FTDI.5
P4_2
  Top 0.254: U2.17 20.95,9.01 C8.2
P4_3
  Top 0.254: U2.18 21.6,9.64 C9.2
TSOC_3V3
  Top 0.61: L2.2 12.45,25.91 TSOC.11B
TSOC_5V0
  Top 0.61: L1.2 12.45,4.57 TSOC.11C
VCC  (via drill 0.36)
  Top 0.254: LED2.+ 40.64,29.21 41.4,29.97 43.18,29.97 43.94,29.21 43.94,25.15 43.69,24.89 v40.64,24.89 | v8,5.21 7.75,5.21 7.49,4.95 | R6.2 v15.49,10.67 | R8.2 17.27,10.46 v17.28,10.71 | R7.2 v17.02,6.1
  Top 0.305: U2.27 27.45,10.69 v27.43,10.67
  Top 0.406: 33.78,2.29 33.27,2.54 28.7,2.54 28.45,2.29 27.94,2.29 FTDI.3 | C15.2 32.26,20.32 v33.02,19.56 | C14.2 v33.27,15.75 34.29,15.75 C17.1
  Top 0.61: v8,5.21 7.62,4.83 | C17.1 35.56,16.76 36.58,15.75 v37.59,15.75 | C2.1 8.64,23.37 8.38,23.62 8.38,24.89 7.11,24.89 | 7.11,24.89 5.33,24.89 4.83,24.38 4.83,21.57 | R1.2 7.11,24.89 | J4.3 37.32,8.89 36.07,8.89 35.05,7.87 C16.1 33.53,7.87 33.02,8.38 33.02,9.4 32.77,9.65 31.37,9.65 C13.1 31.24,11.18 31.5,11.43 v32,11.43 C14.2 | v40.64,19.56 37.35,19.56 J5.3 | C1.1 8.89,12.19 8.64,11.94 8.64,11.18 8.13,10.67 7.35,10.67 J2.3
  Top 0.813: J3.3 4.83,21.57 3.57,21.57 v3.56,21.59 | v3.56,5.08 7.37,5.08 7.49,4.95 7.62,4.83 7.62,1.52 J1.2 | v6.35,14.73 v3.56,14.73 | v37.59,15.75 v40.64,15.75 | v34.8,0.76 34.8,1.78 33.78,2.29 | J4.3 40.62,8.91 v40.64,8.89 | v3.56,10.92 7.1,10.92 J2.3
  Bottom 0.178: 40.66,8.53 40.72,8.53 v40.64,8.89
  Bottom 0.305: v17.02,6.1 8.89,6.1 v8,5.21
  Bottom 0.406: v33.02,19.56 33.02,15.75 v33.27,15.75
  Bottom 0.61: JTAG.1 31.75,29.72 40.64,29.72 v40.64,24.89 | v32,11.43 31.24,10.67 v27.43,10.67 18.55,10.74 v17.28,10.71 v15.49,10.67 7.35,10.67 J2.3
  Bottom 0.813: v3.56,21.59 v3.56,14.73 v3.56,10.92 v3.56,5.08 | v40.64,8.89 v40.64,15.75 v40.64,19.56 v40.64,24.89 | 40.66,8.91 40.66,8.53 40.66,1.03 40.64,1.02 40.64,0.76 v34.8,0.76
VCCD
  Top 0.254: U2.26 26.8,13.09 26.92,13.21
  Top 0.406: 26.92,13.21 28.19,13.21 29.21,14.22 C10.2

### Text on the board
tPlace: SWDIO | VCC | GND | 3V3 | NC | NC | (ATN) | 2_3 | (IRQ) | 2_2 | PatternAgents | Grovey | Four! | 3_1 | 3_0 | 4_0 | 4_1 | 0_0 | 0_1 | 0_2 | 0_3 | 0_6 | 0_7 | 5V | !CTS | 3.3V
bPlace: JTAG | GND | 3V3 | NC | NC | NC | SWD | SWC | !RST | GND | VCC | ANALOG | GND | GND | 3V3 | 2_3 | 2_2 | P2_5 | ANALOG | VCC | P1_2 | P1_1 | PatternAgents | VCC | P2_6 | GND | TSOC_GROVEY_FOUR! | Rev. 3.1 | Serial Number: | ANALOG | GND | P2_4 | ANALOG | P1_0 | VCC | P0_0 | VCC | P2_7 | GND | GND | 5V0 | 3_1 | 3_0 | 4_0 | 4_1 | 0_0 | 0_1 | 0_2 | 0_3 | 0_6 | P0_7 | J1 | 3V3 | VCC | 5V0 | 5V0 | GND | !DTR | TXD | RXD | VCC | GND | !CTS | FTDI | UART